# Altium schematic sheet WIFI Bluetooth.SchDoc: WIFI/Bluetooth
size Tabloid; ApprovedBy: NA; CompanyName: Cospan Design LLC; DrawnBy: David McCoy; Engineer: David McCoy; DocumentNumber: 5; Revision: A; SheetNumber: 5; SheetTotal: 18; Client: OSH; Project: Guppy Buddy; ProjectPrettyName: Guppy Buddy
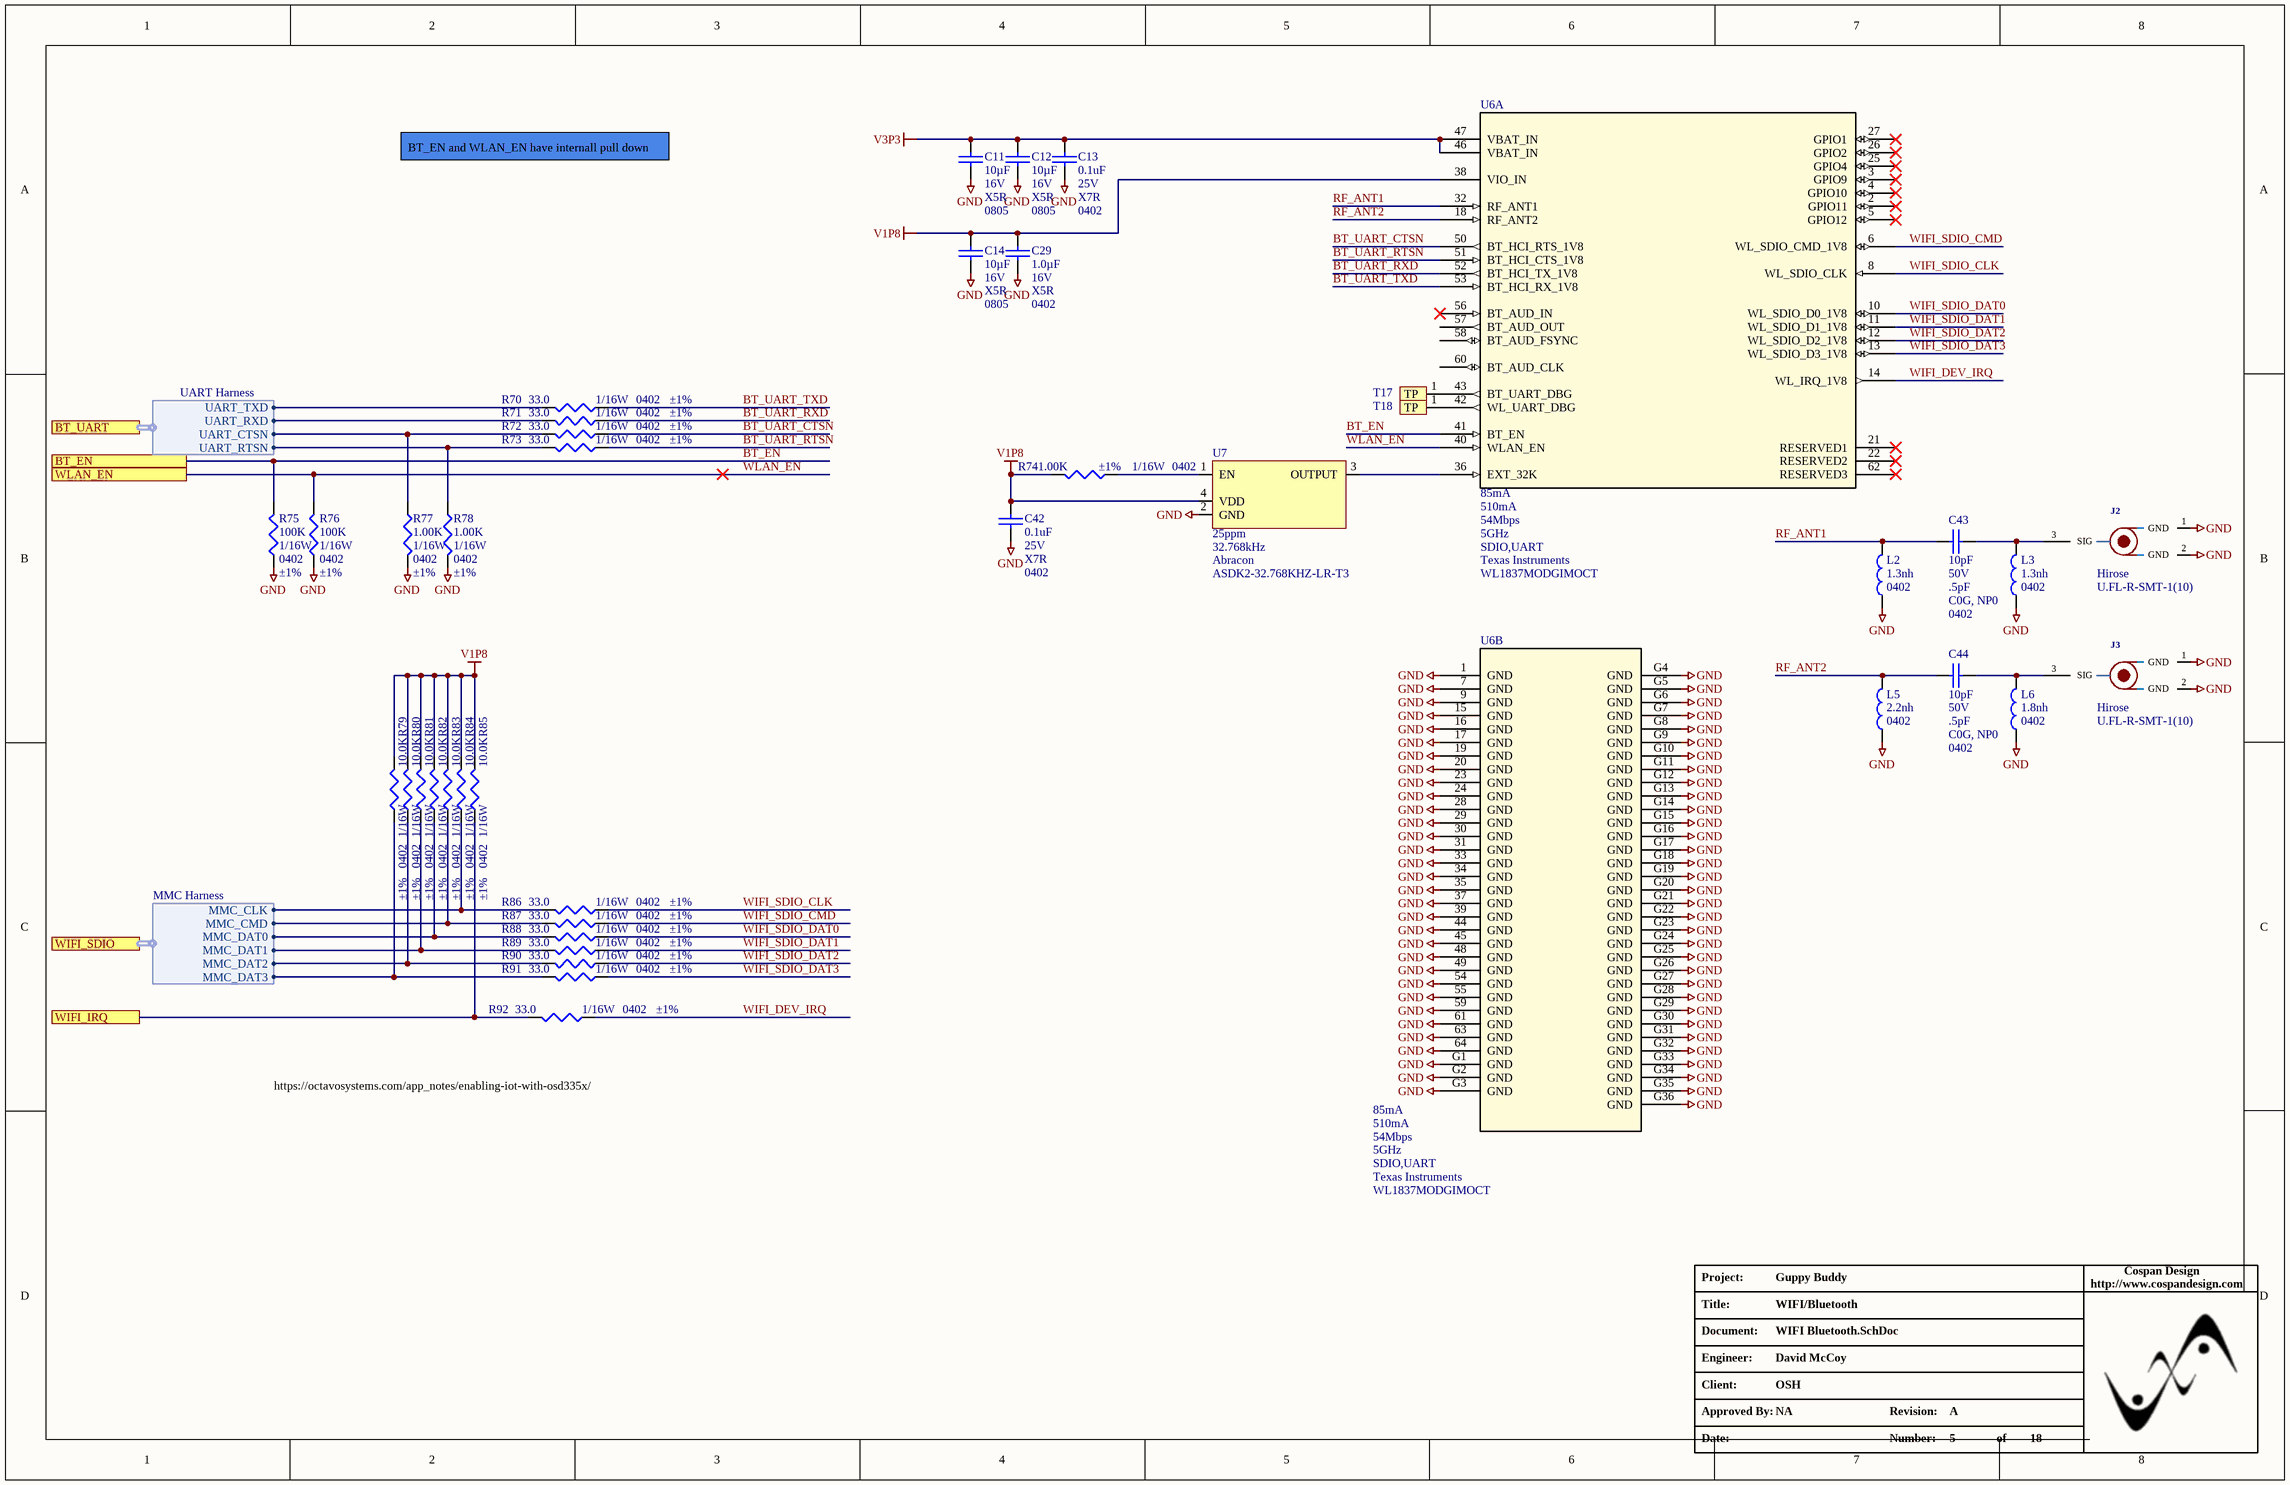
[diagram p0: WIFI Bluetooth.SchDoc]

## Parts
C11  Voltage - Rated: 16V  Temperature Coefficient: X5R  Package / Case: 0805  [C_ERA-0805]  (hidden comment: 10µF)
C12  Voltage - Rated: 16V  Temperature Coefficient: X5R  Package / Case: 0805  [C_ERA-0805]  (hidden comment: 10µF)
C13  Capacitance: 0.1uF  Voltage - Rated: 25V  Temperature Coefficient: X7R  Package / Case: 0402  [C_0402]  (hidden comment: C_0402_0.1UF_25V)
C14  Voltage - Rated: 16V  Temperature Coefficient: X5R  Package / Case: 0805  [C_ERA-0805]  (hidden comment: 10µF)
C29  Capacitance: 1.0µF  Voltage - Rated: 16V  Temperature Coefficient: X5R  Package / Case: 0402  [C_0402]  (hidden comment: 1.0uF)
C42  Capacitance: 0.1uF  Voltage - Rated: 25V  Temperature Coefficient: X7R  Package / Case: 0402  [C_0402]  (hidden comment: C_0402_0.1UF_25V)
C43  Voltage - Rated: 50V  Tolerance: .5pF  Temperature Coefficient: C0G, NP0  Package / Case: 0402  [C_0402]  (hidden comment: 10pF)
C44  Voltage - Rated: 50V  Tolerance: .5pF  Temperature Coefficient: C0G, NP0  Package / Case: 0402  [C_ERA-0402]  (hidden comment: 10pF)
J2  Manufacturer 1: Hirose  [U.FL-R-SMT-1]  (hidden comment: U.FL-R-SMT-1(10))
J3  Manufacturer 1: Hirose  [U.FL-R-SMT-1]  (hidden comment: U.FL-R-SMT-1(10))
L2  Inductance: 1.3nh  Case Code (Imperial): 0402  [R_0402]  (hidden comment: L_0402_1.3nH)
L3  Inductance: 1.3nh  Case Code (Imperial): 0402  [R_0402]  (hidden comment: L_0402_1.3nH)
L5  Inductance: 2.2nh  Case Code (Imperial): 0402  [R_0402]  (hidden comment: L_0402_2.2nH)
L6  Inductance: 1.8nh  Case Code (Imperial): 0402  [R_0402]  (hidden comment: L_0402_1.8nH)
R70  Resistance In Ohms: 33.0  Power (Watts): 1/16W  Case: 0402  Tolerance: ±1%  [R_0402]  (hidden comment: R_0402_33)
R71  Resistance In Ohms: 33.0  Power (Watts): 1/16W  Case: 0402  Tolerance: ±1%  [R_0402]  (hidden comment: R_0402_33)
R72  Resistance In Ohms: 33.0  Power (Watts): 1/16W  Case: 0402  Tolerance: ±1%  [R_0402]  (hidden comment: R_0402_33)
R73  Resistance In Ohms: 33.0  Power (Watts): 1/16W  Case: 0402  Tolerance: ±1%  [R_0402]  (hidden comment: R_0402_33)
R74  Resistance In Ohms: 1.00K  Power (Watts): 1/16W  Case: 0402  Tolerance: ±1%  [R_0402]  (hidden comment: 1.0k Ohms)
R75  Resistance In Ohms: 100K  Power (Watts): 1/16W  Case: 0402  Tolerance: ±1%  [R_0402]  (hidden comment: R_0402_100.0K)
R76  Resistance In Ohms: 100K  Power (Watts): 1/16W  Case: 0402  Tolerance: ±1%  [R_0402]  (hidden comment: R_0402_100.0K)
R77  Resistance In Ohms: 1.00K  Power (Watts): 1/16W  Case: 0402  Tolerance: ±1%  [R_0402]  (hidden comment: 1.0k Ohms)
R78  Resistance In Ohms: 1.00K  Power (Watts): 1/16W  Case: 0402  Tolerance: ±1%  [R_0402]  (hidden comment: 1.0k Ohms)
R79  Resistance In Ohms: 10.0K  Power (Watts): 1/16W  Case: 0402  Tolerance: ±1%  [R_0402]  (hidden comment: R_0402_10.0K)
R80  Resistance In Ohms: 10.0K  Power (Watts): 1/16W  Case: 0402  Tolerance: ±1%  [R_0402]  (hidden comment: R_0402_10.0K)
R81  Resistance In Ohms: 10.0K  Power (Watts): 1/16W  Case: 0402  Tolerance: ±1%  [R_0402]  (hidden comment: R_0402_10.0K)
R82  Resistance In Ohms: 10.0K  Power (Watts): 1/16W  Case: 0402  Tolerance: ±1%  [R_0402]  (hidden comment: R_0402_10.0K)
R83  Resistance In Ohms: 10.0K  Power (Watts): 1/16W  Case: 0402  Tolerance: ±1%  [R_0402]  (hidden comment: R_0402_10.0K)
R84  Resistance In Ohms: 10.0K  Power (Watts): 1/16W  Case: 0402  Tolerance: ±1%  [R_0402]  (hidden comment: R_0402_10.0K)
R85  Resistance In Ohms: 10.0K  Power (Watts): 1/16W  Case: 0402  Tolerance: ±1%  [R_0402]  (hidden comment: R_0402_10.0K)
R86  Resistance In Ohms: 33.0  Power (Watts): 1/16W  Case: 0402  Tolerance: ±1%  [R_0402]  (hidden comment: R_0402_33)
R87  Resistance In Ohms: 33.0  Power (Watts): 1/16W  Case: 0402  Tolerance: ±1%  [R_0402]  (hidden comment: R_0402_33)
R88  Resistance In Ohms: 33.0  Power (Watts): 1/16W  Case: 0402  Tolerance: ±1%  [R_0402]  (hidden comment: R_0402_33)
R89  Resistance In Ohms: 33.0  Power (Watts): 1/16W  Case: 0402  Tolerance: ±1%  [R_0402]  (hidden comment: R_0402_33)
R90  Resistance In Ohms: 33.0  Power (Watts): 1/16W  Case: 0402  Tolerance: ±1%  [R_0402]  (hidden comment: R_0402_33)
R91  Resistance In Ohms: 33.0  Power (Watts): 1/16W  Case: 0402  Tolerance: ±1%  [R_0402]  (hidden comment: R_0402_33)
R92  Resistance In Ohms: 33.0  Power (Watts): 1/16W  Case: 0402  Tolerance: ±1%  [R_0402]  (hidden comment: R_0402_33)
T17  TEST_POINT_SMALL  [TestPointSmall]  (value not drawn)  (no BOM)
T18  TEST_POINT_SMALL  [TestPointSmall]  (value not drawn)  (no BOM)
U6  Current - Receiving: 85mA  Current - Transmitting: 510mA  Data Rate: 54Mbps  Frequency: 5GHz  Interface: SDIO,UART  Manufacturer 1: Texas Instruments  Manufacturer Part Number 1: WL1837MODGIMOCT  [MOC0100A]  (hidden comment: U_WL1837MODGIMOCT)  (parts A,B of 2)
U7  Frequency Stability: 25ppm  Frequency: 32.768kHz  Manufacturer 1: Abracon  Manufacturer Part Number 1: ASDK2-32.768KHZ-LR-T3  [KC2520B]  (hidden comment: U_ASDK2-32.768KHZ-LR-T3)

## Ports
BT_EN, BT_UART (harness UART Harness), WIFI_IRQ, WIFI_SDIO (harness MMC Harness), WLAN_EN

## Harnesses
UART Harness: UART_TXD, UART_RXD, UART_CTSN, UART_RTSN
MMC Harness: MMC_CLK, MMC_CMD, MMC_DAT0, MMC_DAT1, MMC_DAT2, MMC_DAT3

## Nets
GND: C11.1 C12.1 C13.1 C14.1 C29.1 C42.1 J2.1(GND) J2.2(GND) J3.1(GND) J3.2(GND) L2.1 L3.1 L5.1 L6.1 R75.2 R76.2 R77.1 R78.1 U6.1(GND) U6.7(GND) U6.9(GND) U6.15(GND) U6.16(GND) U6.17(GND) U6.19(GND) U6.20(GND) U6.23(GND) U6.24(GND) U6.28(GND) U6.29(GND) U6.30(GND) U6.31(GND) U6.33(GND) U6.34(GND) U6.35(GND) U6.37(GND) U6.39(GND) U6.44(GND) U6.45(GND) U6.48(GND) U6.49(GND) U6.54(GND) U6.55(GND) U6.59(GND) U6.61(GND) U6.63(GND) U6.64(GND) U6.G1(GND) U6.G2(GND) U6.G3(GND) U6.G4(GND) U6.G5(GND) U6.G6(GND) U6.G7(GND) U6.G8(GND) U6.G9(GND) U6.G10(GND) U6.G11(GND) U6.G12(GND) U6.G13(GND) U6.G14(GND) U6.G15(GND) U6.G16(GND) U6.G17(GND) U6.G18(GND) U6.G19(GND) U6.G20(GND) U6.G21(GND) U6.G22(GND) U6.G23(GND) U6.G24(GND) U6.G25(GND) U6.G26(GND) U6.G27(GND) U6.G28(GND) U6.G29(GND) U6.G30(GND) U6.G31(GND) U6.G32(GND) U6.G33(GND) U6.G34(GND) U6.G35(GND) U6.G36(GND) U7.2(GND)
V1P8: C14.2 C29.2 C42.2 R74.1 R79.1 R80.1 R81.1 R82.1 R83.1 R84.1 R85.1 U6.38(VIO_IN) U7.4(VDD)
V3P3: C11.2 C12.2 C13.2 U6.46(VBAT_IN) U6.47(VBAT_IN)
BT_EN: R75.1 U6.41(BT_EN) ; port BT_EN
BT_UART_CTSN: R72.2 U6.50(BT_HCI_RTS_1V8)
BT_UART_RTSN: R73.2 U6.51(BT_HCI_CTS_1V8)
BT_UART_RXD: R71.2 U6.52(BT_HCI_TX_1V8)
BT_UART_TXD: R70.2 U6.53(BT_HCI_RX_1V8)
RF_ANT1: C43.2 L2.2 U6.32(RF_ANT1)
RF_ANT2: C44.2 L5.2 U6.18(RF_ANT2)
WIFI_DEV_IRQ: R92.2 U6.14(WL_IRQ_1V8)
WIFI_IRQ: R85.2 R92.1 ; port WIFI_IRQ
WIFI_SDIO_CLK: R86.2 U6.8(WL_SDIO_CLK)
WIFI_SDIO_CMD: R87.2 U6.6(WL_SDIO_CMD_1V8)
WIFI_SDIO_DAT0: R88.2 U6.10(WL_SDIO_D0_1V8)
WIFI_SDIO_DAT1: R89.2 U6.11(WL_SDIO_D1_1V8)
WIFI_SDIO_DAT2: R90.2 U6.12(WL_SDIO_D2_1V8)
WIFI_SDIO_DAT3: R91.2 U6.13(WL_SDIO_D3_1V8)
WLAN_EN: R76.1 U6.40(WLAN_EN) ; port WLAN_EN
NetC43_1: C43.1 J2.3(SIG) L3.2
NetC44_1: C44.1 J3.3(SIG) L6.2
NetR70_1: R70.1 ; port BT_UART.UART_TXD
NetR71_1: R71.1 ; port BT_UART.UART_RXD
NetR72_1: R72.1 R77.2 ; port BT_UART.UART_CTSN
NetR73_1: R73.1 R78.2 ; port BT_UART.UART_RTSN
NetR74_2: R74.2 U7.1(EN)
NetR79_2: R79.2 R91.1 ; port WIFI_SDIO.MMC_DAT3
NetR80_2: R80.2 R90.1 ; port WIFI_SDIO.MMC_DAT2
NetR81_2: R81.2 R89.1 ; port WIFI_SDIO.MMC_DAT1
NetR82_2: R82.2 R88.1 ; port WIFI_SDIO.MMC_DAT0
NetR83_2: R83.2 R87.1 ; port WIFI_SDIO.MMC_CMD
NetR84_2: R84.2 R86.1 ; port WIFI_SDIO.MMC_CLK
NetT17_1: T17.1(TP) U6.43(BT_UART_DBG)
NetT18_1: T18.1(TP) U6.42(WL_UART_DBG)
NetU6_36: U6.36(EXT_32K) U7.3(OUTPUT)

Not connected (* = marked no-connect by the designer): U6 2(GPIO11)* 3(GPIO9)* 4(GPIO10)* 5(GPIO12)* 21(RESERVED1)* 22(RESERVED2)* 25(GPIO4)* 26(GPIO2)* 27(GPIO1)* 56(BT_AUD_IN)* 57(BT_AUD_OUT) 58(BT_AUD_FSYNC) 60(BT_AUD_CLK) 62(RESERVED3)*

## Notes on the sheet
- BT_EN and WLAN_EN have internall pull down
- https://octavosystems.com/app_notes/enabling-iot-with-osd335x/
- Project:
- http://www.cospandesign.com
- Cospan Design
- Document:
- Engineer:
- Title:
- Client:
- Approved By:
- Revision:
- Date:
- Number:
- of

## Library data of the parts
C11 C12 C14 = C_0805_10UF_16V: CAP CER 10uF 16V X5R 20% 0805; Manufacturer: Taiyo Yuden; Manufacturer Part Number: EMK212BJ106KG-T; Tolerance: ±10%; Supplier 1: Digi-Key; RoHS: RoHS Compliant; Category: Capacitors; Stock 1: 2052124; Pricing 1: 1=0.2, 10=0.139, 100=0.0656, 500=0.04596, 1000=0.03805 (USD); Packaging: Cut Tape (CT); Part Status: Active; Operating Temperature: -55°C ~ 85°C; Features: -; Ratings: -; Applications: General Purpose; Mounting Type: Surface Mount, MLCC; Size / Dimension: 0.079" L x 0.049" W (2.00mm x 1.25mm); Height - Seated (Max): -; Thickness (Max): 0.053" (1.35mm); Lead Spacing: -; Lead Style: -; ComponentLink1URL: http://www.yuden.co.jp/productdata/catalog/en/mlcc01_e.pdf; ComponentLink1Description: http://www.yuden.co.jp/productdata/catalog/en/mlcc01_e.pdf; Supplier Part Number 1: 587-1295-1-ND; Capacitance: 10µF
C13 C42 = C_0402_0.1UF_25V: CAP CER 0.1UF 25V X6S 0402; Manufacturer 1: Yageo; Manufacturer Part Number 1: CC0402KRX7R8BB104; Description 1: Cap Ceramic 0.1uF 25V X7R 10% SMD 0402 125C Paper T/R; Tolerance: 10%; Dissipation Factor: 3.5%; ComponentLink1URL: https://product.tdk.com/info/en/catalog/datasheets/mlcc_commercial_general_en.pdf; ComponentLink1Description: https://product.tdk.com/info/en/catalog/datasheets/mlcc_commercial_general_en.pdf; Supplier 1: Digi-Key; Supplier Part Number 1: 311-2077-1-ND; Stock 1: 0; Pricing 1: 1=0.1, 10=0.048, 100=0.0215, 500=0.01534, 1000=0.01205, 2500=0.01095, 5000=0.01007 (USD); Mount: Surface Mount; Case/Package: 0402; Case Code (Imperial): 0402; Case Code (Metric): 1005; Min Operating Temperature: -55°C; Max Operating Temperature: 125°C; Voltage Rating: 25V; Voltage Rating (DC): 25V; Packaging: Tape and Reel; Dielectric: X7R; Termination: SMD/SMT; Composition: Ceramic; Length: 1mm; Height: 0.5mm; Width: 0.02inch; Thickness: 0.022inch; Depth: 0.5mm; Radiation Hardening: No; Lead Free: Lead Free; Halogen Free: Halogen Free; ComponentLink2URL: https://datasheet.ciiva.com/11464/upy-gphc-x7r-6-3v-to-50v-8-11464889.pdf; ComponentLink2Description: https://datasheet.ciiva.com/11464/upy-gphc-x7r-6-3v-to-50v-8-11464889.pdf; ComponentLink3URL: https://datasheet.ciiva.com/13210/upy-gphc-x7r-6-3v-to-50v-8-12304-13210908.pdf; ComponentLink3Description: https://datasheet.ciiva.com/13210/upy-gphc-x7r-6-3v-to-50v-8-12304-13210908.pdf; ComponentLink4URL: https://datasheet.ciiva.com/17437/upy-gphc-x7r-6-3v-to-50v-8-17437357.pdf; ComponentLink4Description: https://datasheet.ciiva.com/17437/upy-gphc-x7r-6-3v-to-50v-8-17437357.pdf
C29 = C_0402_1.0UF_16V: CAP CER 1.0UF 16V X5R 0402; Manufacturer 1: Samsung; Manufacturer Part Number 1: CL05A105KO5NNNC; Tolerance: 10%; Description 1: Cap Ceramic 1uF 16V X5R 10% SMD 0402 85C Paper T/R; Supplier 1: Digi-Key; Stock 1: 26908; Pricing 1: 1=0.1, 10=0.062, 100=0.0276, 500=0.01968, 1000=0.01547, 2500=0.01406, 5000=0.01294 (USD); Packaging: Tape and Reel; ComponentLink1URL: http://ds.yuden.co.jp/TYCOMPAS/ut/detail.do?productNo=EMK105BJ105KV-F&fileName=EMK105BJ105KV-F_SS&mode=specSheetDownload; ComponentLink1Description: http://ds.yuden.co.jp/TYCOMPAS/ut/detail.do?productNo=EMK105BJ105KV-F&fileName=EMK105BJ105KV-F_SS&mode=specSheetDownload; Supplier Part Number 1: 1276-1067-6-ND; ComponentLink2URL: https://datasheet.ciiva.com/16207/cl05a105ko5nnnc-16207571.pdf; ComponentLink2Description: https://datasheet.ciiva.com/16207/cl05a105ko5nnnc-16207571.pdf; ComponentLink3URL: https://datasheet.ciiva.com/15195/getdatasheetpartid-355272-15195629.pdf; ComponentLink3Description: https://datasheet.ciiva.com/15195/getdatasheetpartid-355272-15195629.pdf; Mount: Surface Mount; Case/Package: 0402; Case Code (Metric): 1005; Case Code (Imperial): 0402; Contact Plating: Tin; Min Operating Temperature: -55°C; Max Operating Temperature: 85°C; Dielectric: X5R; Package Quantity: 1; Voltage Rating: 16V; Voltage: 16V; Length: 1mm; Height: 0.5mm; Width: 0.02inch; Thickness: 0.022inch; Depth: 0.5mm; Radiation Hardening: No
C43 C44 = C_0402_10PF_50V: CAP CER 10PF 50V NP0 0402; Manufacturer: Taiyo Yuden; Manufacturer Part Number: UMK105CG100DV-F; Supplier 1: Digi-Key; Supplier Part Number 1: 587-1947-1-ND; RoHS: RoHS Compliant; Category: Capacitors; Stock 1: 47289; Pricing: 1=0.07, 10=0.045, 50=0.0216, 100=0.0162, 250=0.01172, 500=0.00864, 1000=0.00585, 5000=0.0045 (USD); Mounting Type: Surface Mount, MLCC; Operating Temperature: -55°C ~ 125°C; Applications: General Purpose; Ratings: -; Size / Dimension: 0.039" L x 0.020" W (1.00mm x 0.50mm); Height - Seated (Max): -; Thickness (Max): 0.022" (0.55mm); Lead Spacing: -; Features: -; Packaging: Cut Tape (CT); Lead Style: -; ComponentLink1URL: http://www.yuden.co.jp/productdata/catalog/en/mlcc02_e.pdf; ComponentLink1Description: http://www.yuden.co.jp/productdata/catalog/en/mlcc02_e.pdf; Capacitance: 10pF
J2 J3 = J_U.FL-R-SMT-1: CONN UMC JACK STR 50 OHM SMD; GateName_1: G$1; Body Plating: Silver; Body Material: Bronze; Dielectric Material: Polymer; Impedance: 50R; Connector Type: Receptacle,Coaxial,Male Pin; Max Frequency: 6GHz; Gender: Male; Wire/Cable Type: Coaxial; Insulation Resistance: 500MR; SymbolName_1: U.FL-R-SMT-1; LibraryName: GHI-Connectors; DeviceSetName: U.FL-R-SMT-1; Supplier 1: Digi-Key; Supplier Part Number 1: H11891DKR-ND; Description 1: CONN UMC JACK STR 50 OHM SMD; Stock 1: 382010; Pricing 1: 1=1.31, 10=1.15, 25=1.0824, 50=1.0374, 100=0.9922, 250=0.902, 500=0.8118, 1000=0.7216 (USD); Mount: Surface Mount,Through Hole,PCB; Contact Material: Bronze,Brass; Contact Plating: Gold; Housing Colour: Beige; Min Operating Temperature: -40°C; Max Operating Temperature: 90°C; Packaging: Tape and Reel; Package Quantity: 2500; Termination: Solder; Fastening Type: Snap; Orientation: Straight; Frequency: 6GHz; Length: 3mm; Depth: 3.1mm; Radiation Hardening: No; Lead Free: Lead Free; REACH SVHC: No SVHC; ComponentLink1URL: https://datasheet.ciiva.com/7651/91524-7651914.pdf; ComponentLink1Description: https://datasheet.ciiva.com/7651/91524-7651914.pdf; ComponentLink2URL: https://datasheet.ciiva.com/11762/0900766b8105243f-11762474.pdf; ComponentLink2Description: https://datasheet.ciiva.com/11762/0900766b8105243f-11762474.pdf; ComponentLink3URL: https://datasheet.ciiva.com/7651/91524-7651915.pdf; ComponentLink3Description: https://datasheet.ciiva.com/7651/91524-7651915.pdf; NAME: *; Manufacturer Part Number 1: U.FL-R-SMT-1(10)
L2 L3 = L_0402_1.3nH: FIXED IND 1.3NH 1A 90 MOHM; Manufacturer 1: Murata; Manufacturer Part Number 1: LQG15HS1N3S02D; Description 1: Inductor RF Chip Multi-Layer 1.3nH 0.3nH 100MHz 8Q-Factor Air 300mA 90mOhm DCR 0402 Paper T/R; Core Material: Air; Q Factor: 8; Self Resonant Frequency: 6GHz; Shielding: Unshielded; Current Rating: 300mA; Tolerance: 5%; DC Resistance (DCR): 90mR; Test Frequency: 100MHz; ComponentLink1URL: http://search.murata.co.jp/Ceramy/image/img/PDF/ENG/L0075S0084LQP15M.pdf; ComponentLink1Description: http://search.murata.co.jp/Ceramy/image/img/PDF/ENG/L0075S0084LQP15M.pdf; ComponentLink2URL: https://datasheet.ciiva.com/8510/l0075s0083lqg15hs-8510837.pdf; ComponentLink2Description: https://datasheet.ciiva.com/8510/l0075s0083lqg15hs-8510837.pdf; ComponentLink3URL: https://datasheet.ciiva.com/4977/o05e-4977799.pdf; ComponentLink3Description: https://datasheet.ciiva.com/4977/o05e-4977799.pdf; ComponentLink4URL: https://datasheet.ciiva.com/6690/l0075s0083lqg15hs-6690759.pdf; ComponentLink4Description: https://datasheet.ciiva.com/6690/l0075s0083lqg15hs-6690759.pdf; ComponentLink5URL: https://datasheet.ciiva.com/6690/l0075s0083lqg15hs-6690762.pdf; ComponentLink5Description: https://datasheet.ciiva.com/6690/l0075s0083lqg15hs-6690762.pdf; ComponentLink6URL: https://datasheet.ciiva.com/6690/l0075s0083lqg15hs-6690763.pdf; ComponentLink6Description: https://datasheet.ciiva.com/6690/l0075s0083lqg15hs-6690763.pdf; ComponentLink7URL: https://datasheet.ciiva.com/11801/0900766b80f10809-11801404.pdf; ComponentLink7Description: https://datasheet.ciiva.com/11801/0900766b80f10809-11801404.pdf; ComponentLink8URL: https://datasheet.ciiva.com/17247/l0075s0083lqg15hs-17247117.pdf; ComponentLink8Description: https://datasheet.ciiva.com/17247/l0075s0083lqg15hs-17247117.pdf; Supplier 1: Digi-Key; Supplier Part Number 1: 490-6568-6-ND; Stock 1: 37779; Pricing 1: 1=0.1, 10=0.061, 100=0.0404, 500=0.03366, 1000=0.02827, 2500=0.02423 (USD); Mount: Surface Mount; Case/Package: 0402; Case Code (Metric): 1005; Min Operating Temperature: -55°C; Max Operating Temperature: 125°C; Packaging: Tape and Reel; Package Quantity: 10000; Max DC Current: 300mA; Termination: SMD/SMT; Current: 300mA; DC Current: 300mA; Military Standard: Not; Length: 1mm; Height: 0.5mm; Width: 0.5mm; Height - Seated (Max): 0.022inch; Depth: 0.55mm; Radiation Hardening: No; ComponentLink9URL: https://datasheet.ciiva.com/17279/l0075s0083lqg15hs-17279241.pdf; ComponentLink9Description: https://datasheet.ciiva.com/17279/l0075s0083lqg15hs-17279241.pdf; ComponentLink10URL: https://datasheet.ciiva.com/6705/l0075s0083lqg15hs-6705242.pdf; ComponentLink10Description: https://datasheet.ciiva.com/6705/l0075s0083lqg15hs-6705242.pdf; ComponentLink11URL: https://datasheet.ciiva.com/6705/l0075s0083lqg15hs-6705243.pdf; ComponentLink11Description: https://datasheet.ciiva.com/6705/l0075s0083lqg15hs-6705243.pdf; ComponentLink12URL: https://datasheet.ciiva.com/6705/l0075s0083lqg15hs-6705244.pdf; ComponentLink12Description: https://datasheet.ciiva.com/6705/l0075s0083lqg15hs-6705244.pdf; ComponentLink13URL: https://datasheet.ciiva.com/11801/0900766b8090d53b-11801407.pdf; ComponentLink13Description: https://datasheet.ciiva.com/11801/0900766b8090d53b-11801407.pdf
L5 = L_0402_2.2nH: FIXED IND 2.2NH 950MA 150 MOHM; Manufacturer 1: Murata; Manufacturer Part Number 1: LQG15HN2N2S02D; Description 1: FIXED IND 2.2NH 300MA 150 MOHM; Core Material: Air; Current Rating: 300mA; Shielding: Unshielded; Q Factor: 8; Self Resonant Frequency: 6GHz; DC Resistance (DCR): 150mR; Test Frequency: 100MHz; ComponentLink1URL: http://search.murata.co.jp/Ceramy/image/img/PDF/ENG/L0075S0084LQP15M.pdf; ComponentLink1Description: http://search.murata.co.jp/Ceramy/image/img/PDF/ENG/L0075S0084LQP15M.pdf; ComponentLink2URL: https://datasheet.ciiva.com/8510/l0075s0083lqg15hs-8510837.pdf; ComponentLink2Description: https://datasheet.ciiva.com/8510/l0075s0083lqg15hs-8510837.pdf; ComponentLink3URL: https://datasheet.ciiva.com/4977/o05e-4977799.pdf; ComponentLink3Description: https://datasheet.ciiva.com/4977/o05e-4977799.pdf; ComponentLink4URL: https://datasheet.ciiva.com/6690/l0075s0083lqg15hs-6690759.pdf; ComponentLink4Description: https://datasheet.ciiva.com/6690/l0075s0083lqg15hs-6690759.pdf; ComponentLink5URL: https://datasheet.ciiva.com/6690/l0075s0083lqg15hs-6690762.pdf; ComponentLink5Description: https://datasheet.ciiva.com/6690/l0075s0083lqg15hs-6690762.pdf; ComponentLink6URL: https://datasheet.ciiva.com/6690/l0075s0083lqg15hs-6690763.pdf; ComponentLink6Description: https://datasheet.ciiva.com/6690/l0075s0083lqg15hs-6690763.pdf; ComponentLink7URL: https://datasheet.ciiva.com/11801/0900766b80f10809-11801404.pdf; ComponentLink7Description: https://datasheet.ciiva.com/11801/0900766b80f10809-11801404.pdf; ComponentLink8URL: https://datasheet.ciiva.com/17247/l0075s0083lqg15hs-17247117.pdf; ComponentLink8Description: https://datasheet.ciiva.com/17247/l0075s0083lqg15hs-17247117.pdf; Supplier 1: Digi-Key; Supplier Part Number 1: 490-1077-6-ND; Stock 1: 13661; Pricing 1: 1=0.1, 10=0.061, 100=0.0404, 500=0.03366, 1000=0.02827, 2500=0.02423 (USD); Mount: Surface Mount; Case/Package: 0402; Number of Pins: 2; Case Code (Metric): 1005; Min Operating Temperature: -55°C; Max Operating Temperature: 125°C; Package Quantity: 10000; Packaging: Tape and Reel; Max DC Current: 300mA; Termination: SMD/SMT; DC Current: 300mA; Military Standard: Not; Length: 1mm; Height: 0.02inch; Width: 0.02inch; Height - Seated (Max): 0.022inch; Depth: 0.55mm; Radiation Hardening: No; REACH SVHC: No SVHC; Lead Free: Lead Free; ComponentLink9URL: https://datasheet.ciiva.com/1063/l0075s0083lqg15hn-1063840.pdf; ComponentLink9Description: https://datasheet.ciiva.com/1063/l0075s0083lqg15hn-1063840.pdf; ComponentLink10URL: https://datasheet.ciiva.com/11801/0900766b80f10808-11801393.pdf; ComponentLink10Description: https://datasheet.ciiva.com/11801/0900766b80f10808-11801393.pdf; ComponentLink11URL: https://datasheet.ciiva.com/8002/66026-8002501.pdf; ComponentLink11Description: https://datasheet.ciiva.com/8002/66026-8002501.pdf; ComponentLink12URL: https://datasheet.ciiva.com/17247/l0075s0083lqg15hn-17247093.pdf; ComponentLink12Description: https://datasheet.ciiva.com/17247/l0075s0083lqg15hn-17247093.pdf; ComponentLink13URL: https://datasheet.ciiva.com/18090/getdatasheetpartid-210549-18090181.pdf; ComponentLink13Description: https://datasheet.ciiva.com/18090/getdatasheetpartid-210549-18090181.pdf; ComponentLink14URL: https://datasheet.ciiva.com/8510/l0075s0083lqg15hn-8510908.pdf; ComponentLink14Description: https://datasheet.ciiva.com/8510/l0075s0083lqg15hn-8510908.pdf; ComponentLink15URL: https://datasheet.ciiva.com/5740/66026-5740734.pdf; ComponentLink15Description: https://datasheet.ciiva.com/5740/66026-5740734.pdf
L6 = L_0402_1.8nH: FIXED IND 1.8NH 950MA 100 MOHM; Manufacturer 1: Murata; Manufacturer Part Number 1: LQG15HS1N8S02D; Description 1: Inductor RF Chip Multi-Layer 1.8nH 0.3nH 100MHz 8Q-Factor Air 300mA 100mOhm DCR 0402 Paper T/R; Core Material: Air; Self Resonant Frequency: 6GHz; Current Rating: 300mA; Shielding: Unshielded; Q Factor: 8; DC Resistance (DCR): 100mR; Test Frequency: 100MHz; ComponentLink1URL: http://search.murata.co.jp/Ceramy/image/img/PDF/ENG/L0075S0084LQP15M.pdf; ComponentLink1Description: http://search.murata.co.jp/Ceramy/image/img/PDF/ENG/L0075S0084LQP15M.pdf; Supplier 1: Digi-Key; Supplier Part Number 1: 490-2613-6-ND; Stock 1: 67587; Pricing 1: 1=0.1, 10=0.056, 100=0.0376, 500=0.03136, 1000=0.02633, 2500=0.02257 (USD); Mount: Surface Mount; Case/Package: 0402; Case Code (Metric): 1005; Min Operating Temperature: -55°C; Max Operating Temperature: 125°C; Packaging: Tape and Reel; Package Quantity: 1; Max DC Current: 300mA; Termination: SMD/SMT; DC Current: 300mA; Military Standard: Not; Length: 0.039inch; Height: 0.5mm; Width: 0.02inch; Height - Seated (Max): 0.022inch; Depth: 0.55mm; Radiation Hardening: No; Lead Free: Lead Free; ComponentLink2URL: https://datasheet.ciiva.com/8510/l0075s0083lqg15hs-8510837.pdf; ComponentLink2Description: https://datasheet.ciiva.com/8510/l0075s0083lqg15hs-8510837.pdf; ComponentLink3URL: https://datasheet.ciiva.com/4977/o05e-4977799.pdf; ComponentLink3Description: https://datasheet.ciiva.com/4977/o05e-4977799.pdf; ComponentLink4URL: https://datasheet.ciiva.com/6690/l0075s0083lqg15hs-6690759.pdf; ComponentLink4Description: https://datasheet.ciiva.com/6690/l0075s0083lqg15hs-6690759.pdf; ComponentLink5URL: https://datasheet.ciiva.com/6690/l0075s0083lqg15hs-6690762.pdf; ComponentLink5Description: https://datasheet.ciiva.com/6690/l0075s0083lqg15hs-6690762.pdf; ComponentLink6URL: https://datasheet.ciiva.com/6690/l0075s0083lqg15hs-6690763.pdf; ComponentLink6Description: https://datasheet.ciiva.com/6690/l0075s0083lqg15hs-6690763.pdf; ComponentLink7URL: https://datasheet.ciiva.com/11801/0900766b80f10809-11801404.pdf; ComponentLink7Description: https://datasheet.ciiva.com/11801/0900766b80f10809-11801404.pdf; ComponentLink8URL: https://datasheet.ciiva.com/17247/l0075s0083lqg15hs-17247117.pdf; ComponentLink8Description: https://datasheet.ciiva.com/17247/l0075s0083lqg15hs-17247117.pdf
R70-R73 R86-R92 = R_0402_33: RES 33.0 OHM 1/16W 1% 0402 SMD; Manufacturer: Yageo; Manufacturer Part Number: RC0402FR-0733RL; Resistance (Ohms): 33; Temperature Coefficient: ±100ppm/°C; Supplier 1: Digi-Key; Supplier Part Number 1: 311-33.0LRCT-ND; RoHS: RoHS Compliant; Category: Resistors; Stock 1: 733920; Pricing: 10=0.014, 50=0.0104, 100=0.0079, 250=0.00584, 500=0.00432, 1000=0.00288 (USD); Composition: Thick Film; Features: -; Size / Dimension: 0.039" L x 0.020" W (1.00mm x 0.50mm); Height: 0.014" (0.35mm); Number of Terminations: 2; Packaging: Cut Tape (CT); Package / Case: 0402 (1005 Metric); ComponentLink1URL: http://www.yageo.com/documents/recent/PYu-RC0402_51_RoHS_L_6.pdf; ComponentLink1Description: http://www.yageo.com/documents/recent/PYu-RC0402_51_RoHS_L_6.pdf
R74 R77 R78 = R_0402_1.0K: RES 1.00K OHM 1/16W 1% 0402 SMD; Manufacturer: Yageo; Manufacturer Part Number: RC0402FR-071KL; Resistance (Ohms): 1K; Temperature Coefficient: ±100ppm/°C; Supplier 1: Digi-Key; Supplier Part Number 1: 311-1.00KLRCT-ND; RoHS: RoHS Compliant; Category: Resistors; Stock 1: 2103351; Pricing: 10=0.014, 100=0.0063, 500=0.00382, 1000=0.0027, 5000=0.00203 (USD); Composition: Thick Film; Features: -; Package / Case: 0402 (1005 Metric); Size / Dimension: 0.039" L x 0.020" W (1.00mm x 0.50mm); Height: 0.016" (0.40mm); Number of Terminations: 2; Packaging: Cut Tape (CT); ComponentLink1URL: http://www.yageo.com/documents/recent/PYu-RC0402_51_RoHS_L_6.pdf; ComponentLink1Description: http://www.yageo.com/documents/recent/PYu-RC0402_51_RoHS_L_6.pdf
R75 R76 = R_0402_100.0K: RES 100K OHM 1/16W 1% 0402 SMD; Manufacturer: Stackpole Electronics Inc; Manufacturer Part Number: RMCF0402FT100K; Temperature Coefficient: ±100ppm/°C; RoHS: RoHS Compliant; Category: Resistors; Composition: Thick Film; Features: -; Lead Style: Surface Mount (SMD - SMT); Packaging: Cut Tape (CT); Resistance (Ohms): 100k; Package / Case: 0402 (1005 Metric); Supplier Device Package: 0402; Size / Dimension: 0.039" L x 0.020" W (1.00mm x 0.50mm); Height: 0.016" (0.40mm); Number of Terminations: 2; Supplier 1: Digi-Key; Supplier Part Number 1: RMCF0402FT100KCT-ND; Stock 1: 18746; Pricing: 1=0.04, 10=0.025, 50=0.0138, 100=0.0105, 250=0.0078, 500=0.00576, 1000=0.00384, 2500=0.00324, 5000=0.0027 (USD); ComponentLink1URL: http://www.seielect.com/Catalog/SEI-RMCF_RMCP.pdf; ComponentLink1Description: http://www.seielect.com/Catalog/SEI-RMCF_RMCP.pdf
R79-R85 = R_0402_10.0K: RES 10.0K OHM 1/16W 1% 0402 SMD; Manufacturer: Stackpole Electronics Inc; Manufacturer Part Number: RMCF0402FT10K0; Resistance (Ohms): 10k; Temperature Coefficient: ±100ppm/°C; Supplier 1: Digi-Key; Supplier Part Number 1: RMCF0402FT10K0CT-ND; RoHS: RoHS Compliant; Category: Resistors; Stock 1: 234525; Pricing: 1=0.04, 10=0.025, 50=0.0138, 100=0.0105, 250=0.0078, 500=0.00576, 1000=0.00384, 2500=0.00324, 5000=0.0027 (USD); Composition: Thick Film; Features: -; Package / Case: 0402 (1005 Metric); Size / Dimension: 0.039" L x 0.020" W (1.00mm x 0.50mm); Height: 0.016" (0.40mm); Number of Terminations: 2; Packaging: Cut Tape (CT); ComponentLink1URL: http://www.seielect.com/Catalog/SEI-RMCF_RMCP.pdf; ComponentLink1Description: http://www.seielect.com/Catalog/SEI-RMCF_RMCP.pdf
T17 T18 = TEST_POINT_SMALL: OSCILLOSCOPE TEST POINT
U6 = U_WL1837MODGIMOCT: WiLink Wi-Fi 2.4/5GHz MIMO BT/BLE; Sensitivity: -95dBm; Supplier 1: Digi-Key; Supplier Part Number 1: 296-43667-6-ND; Description 1: WiLink Wi-Fi 2.4/5GHz MIMO BT/BLE; Stock 1: 813; Pricing 1: 1=36.1, 10=33.321, 25=30.544, 100=28.23 (USD); Mount: Surface Mount; Case/Package: SMD/SMT; Min Operating Temperature: -40°C; Max Operating Temperature: 85°C; Packaging: Tape and Reel; Lead Free: Contains Lead; ComponentLink1URL: http://www.ti.com/lit/ds/symlink/wl1837mod.pdf; ComponentLink1Description: http://www.ti.com/lit/ds/symlink/wl1837mod.pdf
U7 = U_ASDK2-32.768KHZ-LR-T3: 32.768kHz CMOS XO (Standard) Oscillator Surface Mount 1.8V 1.5mA Enable/Disable; Supplier 1: Digi-Key; Supplier Part Number 1: 535-13597-6-ND; Description 1: 32.768kHz CMOS XO (Standard) Oscillator Surface Mount 1.8V 1.5mA Enable/Disable; Stock 1: 8834; Pricing 1: 1=1.39, 10=1.324, 50=1.2936, 100=1.1088, 500=1.078, 1000=0.9086 (USD); Mount: Surface Mount; Case/Package: SMD/SMT; Min Operating Temperature: -40°C; Max Operating Temperature: 85°C; Packaging: Cut Tape; Max Supply Current: 1.5mA; Length: 0.098inch; Height: 0.037inch; Width: 0.079inch; ComponentLink1URL: http://www.abracon.com/Oscillators/ASDK.pdf; ComponentLink1Description: http://www.abracon.com/Oscillators/ASDK.pdf